# EAGLE design esp12_Epaper4.2 (EAGLE 9.6.0)
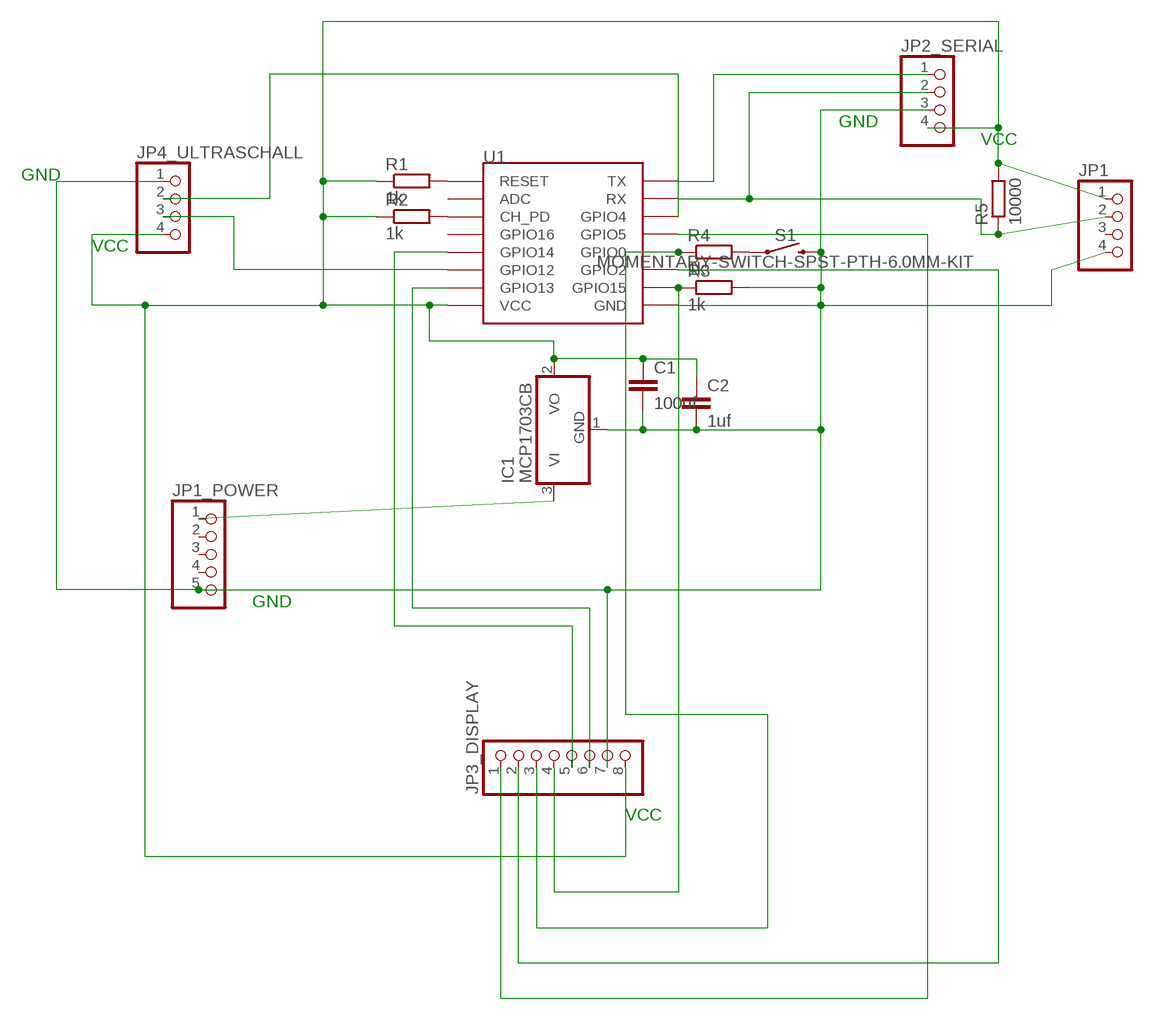
[diagram p0: schematic, sheet 1]

## Parts
C1  100uf  C-EU025-050X050  [C025-050X050]
C2  1uf  C-EU025-050X050  [C025-050X050]
IC1  MCP1703CB  [SOT23]
JP1  PINHD-1X4  [1X04]
JP1_POWER  PINHD-1X5  [1X05]
JP2_SERIAL  PINHD-1X4/90  [1X04/90]
JP3_DISPLAY  PINHD-1X8/90  [1X08/90]
JP4_ULTRASCHALL  PINHD-1X4  [1X04]
R1  1k  R-EU_R1206  [R1206]
R2  1k  R-EU_R1206  [R1206]
R3  1k  R-EU_R1206  [R1206]
R4  1k  R-EU_R1206  [R1206]
R5  10000  R-EU_M1206  [M1206]
S1  MOMENTARY-SWITCH-SPST-PTH-6.0MM-KIT  [TACTILE_SWITCH_PTH_6.0MM_KIT]
U1  ESP12  [ESP12]

## Nets
GND: C1.2 C2.2 IC1.1(GND) JP1.4 JP1_POWER.5 JP2_SERIAL.3 JP3_DISPLAY.7 JP4_ULTRASCHALL.1 R3.2 S1.3 U1.GND
N$2: R1.2 U1.RESET
N$3: R2.2 U1.CH_PD
N$4: JP3_DISPLAY.3 R4.1 U1.GPIO0
N$5: JP4_ULTRASCHALL.2 U1.GPIO4
N$6: R4.2 S1.1
N$7: JP2_SERIAL.1 U1.TX
N$8: JP1.2 JP2_SERIAL.2 R5.1 U1.RX
N$10: IC1.3(VI) JP1_POWER.1
N$11: JP3_DISPLAY.5 U1.GPIO14
N$12: JP3_DISPLAY.6 U1.GPIO13
N$14: JP3_DISPLAY.2 U1.GPIO2
N$15: JP3_DISPLAY.1 U1.GPIO5
N$16: JP4_ULTRASCHALL.3 U1.GPIO12
N$20: JP3_DISPLAY.4 R3.1 U1.GPIO15
VCC: C1.1 C2.1 IC1.2(VO) JP1.1 JP2_SERIAL.4 JP3_DISPLAY.8 JP4_ULTRASCHALL.4 R1.1 R2.1 R5.2 U1.VCC
Unconnected: JP1.3 JP1_POWER.2 JP1_POWER.3 JP1_POWER.4 U1.ADC U1.GPIO16

## Notes on the sheet
- GND
- VCC
- GND
- VCC
- GND
- VCC

## Library data of the parts
C1 C2 = rcl:C-EU: CAPACITOR, European symbol; SPICEPREFIX: C
IC1 = linear:MCP1703: 250 mA, 16V, Low Quiescent Current LDO Regulator Source: http://ww1.microchip.com/downloads/en/DeviceDoc/22049b.pdf
JP1 JP2_SERIAL JP4_ULTRASCHALL = pinhead:PINHD-1X4: PIN HEADER
JP1_POWER = pinhead:PINHD-1X5: PIN HEADER
JP3_DISPLAY = pinhead:PINHD-1X8: PIN HEADER
R1-R5 = rcl:R-EU_: RESISTOR, European symbol; SPICEPREFIX: R
S1 = SparkFun-Switches:MOMENTARY-SWITCH-SPST: Momentary Switch (Pushbutton) - SPST Normally-open (NO) SPST momentary switches (buttons, pushbuttons). Variants PTH-12MM - 12mm square, through-hole Momentary Pushbutton Switch - 12mm Square <https://www.sparkfun.com/products/9190> (COM-09190) PTH-6.0MM, PTH-6.0MM-KIT - 6.0mm square, through-hole Mini Pushbutton Switch <https://www.sparkfun.com/products/97> (COM-00097) KIT package intended for soldering kit's - only one side of pads' copper is exposed. PTH-RIGHT-ANGLE-KIT - Right-angle, through-hole Right Angle Tactile Button <https://www.sparkfun.com/products/10791> - Used on SparkFun BigTime Watch Kit <https://www.sparkfun.com/products/11734> SMD-12MM - 12mm square, surface-mount Tactile Button - SMD (12mm) <https://www.sparkfun.com/products/12993> (COM-12993) Used on SparkFun PicoBoard <https://www.sparkfun.com/products/11888> SMD-4.5MM - 4.5mm Square Trackball Switch Used on SparkFun Blackberry Trackballer Breakout <https://www.sparkfun.com/products/13169> SMD-4.6MMX2.8MM - 4.60mm x 2.80mm, surface mount Used on SparkFun SAMD21 Mini Breakout <https://www.sparkfun.com/products/13664> SMD-5.2MM, SMD-5.2-REDUNDANT - 5.2mm square, surface-mount Mini Pushbutton Switch - SMD <https://www.sparkfun.com/products/8720> (COM-08720) Used on Arduino Pro Mini <https://www.sparkfun.com/products/11114> REDUNDANT package connects both switch circuits together SMD-6.0X3.5MM - 6.0 x 3.5mm, surface mount Momentary Reset Switch SMD <https://www.sparkfun.com/products/8229> (COM-08229) SMD-6.2MM-TALL - 6.2mm square, surface mount Tactile Button - SMD (6mm) <https://www.sparkfun.com/products/12992> Used on SparkFun Digital Sandbox <https://www.sparkfun.com/products/12651> SMD-RIGHT-ANGLE - Right-angle, surface mount Used on SparkFun Block for Intel® Edison - Arduino <https://www.sparkfun.com/products/13036>; PROD_ID: SWCH-08441; SF_SKU: COM-00097
U1 = esp8266modules:ESP12: ESP8266 Wifi module 12

## Board
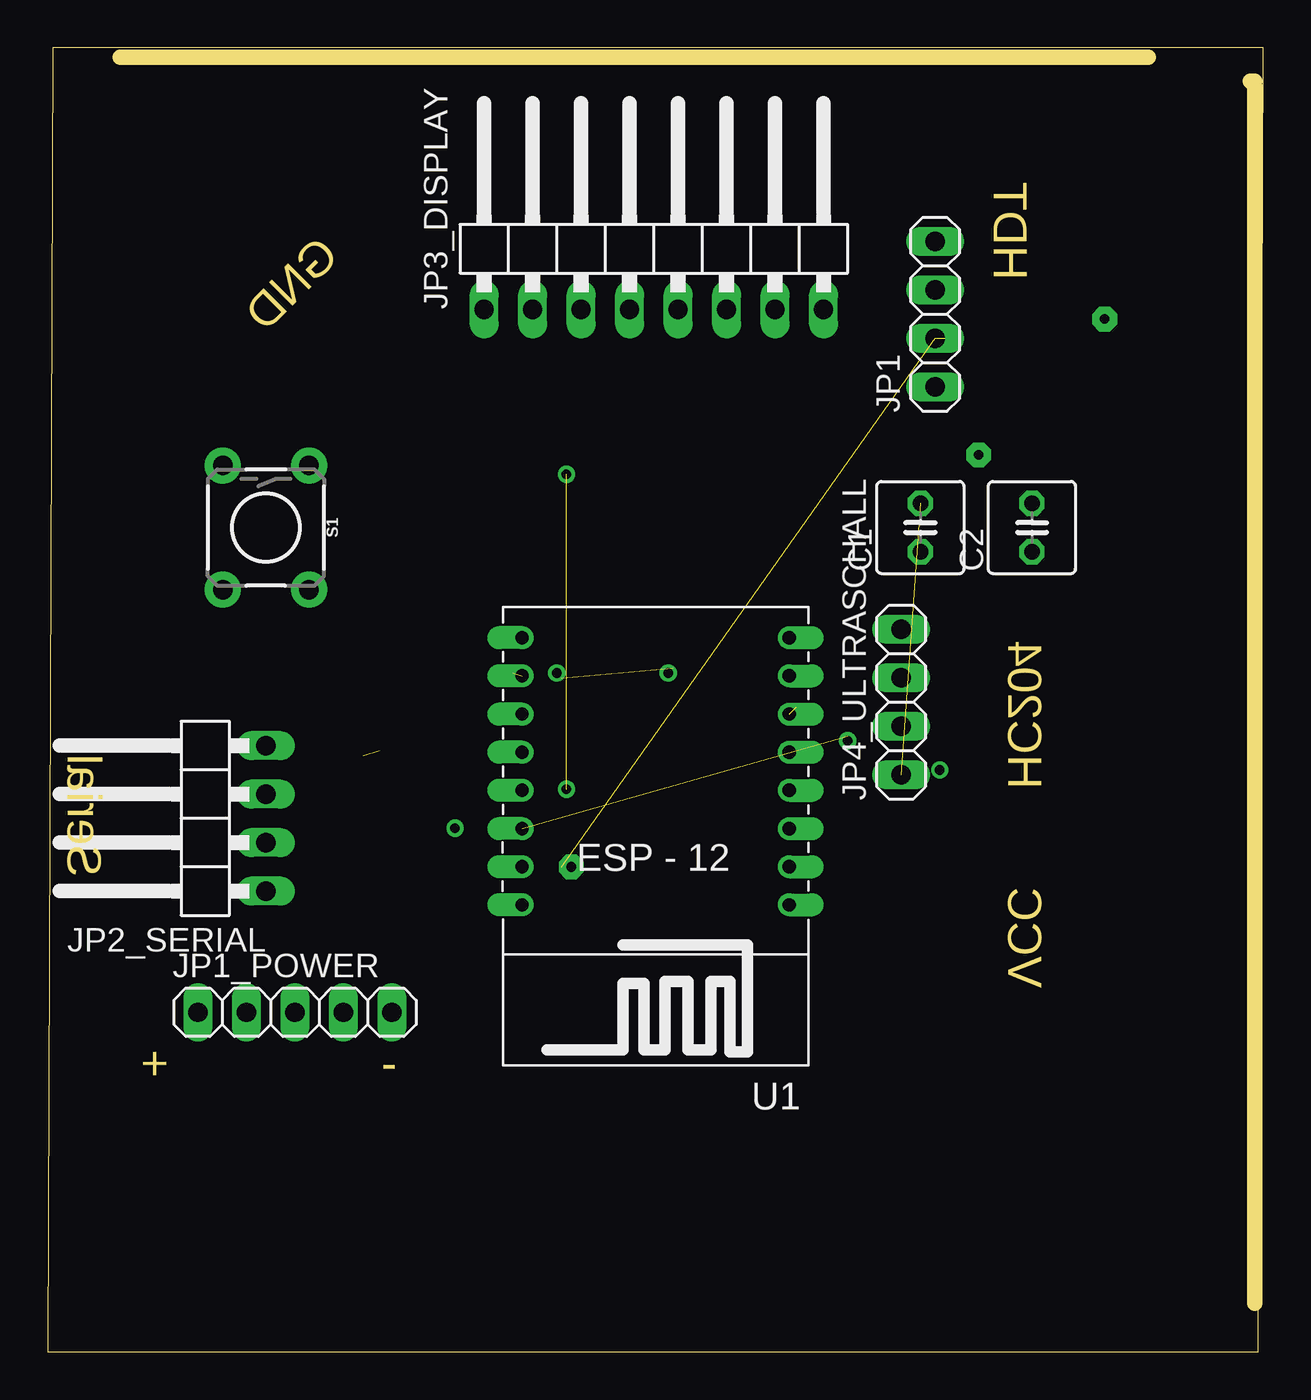
[diagram p1: board, top side]
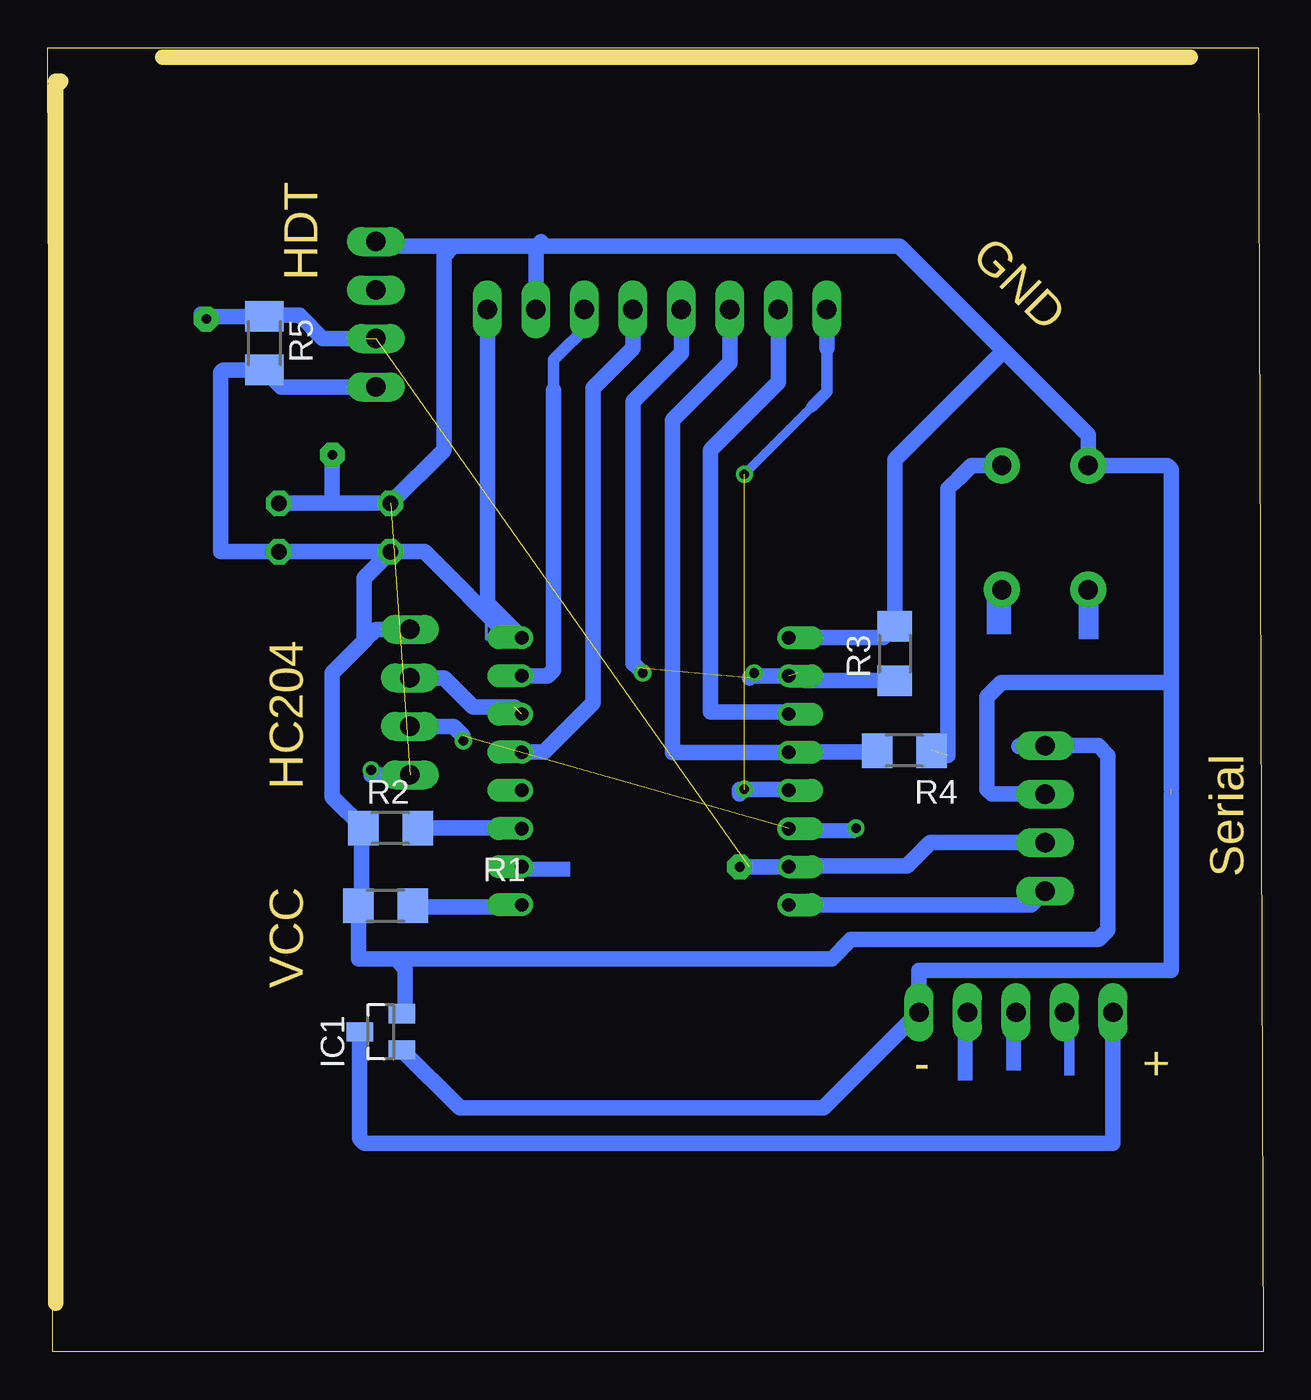
[diagram p2: board, bottom side, seen from below]

Size 63.68 x 68.32 mm. Coordinates in mm from the lower left corner, seen from the top.
Outline: 0,0 63.42,0 63.68,68.32 0.25,68.32 0,0
Copper layers (1*16): Top 0.035mm / dielectric 1.5mm / Bottom 0.035mm
Design rules "default": minimum track width 6mil, minimum drill 0.35mm, track to track 6mil, track to pad 6mil, pad to pad 6mil, via to via 6mil, smd to smd 6mil, copper to edge 40mil, drill to drill 6mil, minimum pad ring 10mil, minimum via ring 8mil, stop-mask expansion 4mil, vias tented up to drill 0mil, thermal gap 10mil
Milling: 4 lines

### Footprints (pad centres in the part's own frame; a part is rotated, then mirrored left to right if it is on the bottom)
C025-050X050 = drill 0.813 octagon: 1 -1.27,0; 2 1.27,0
SOT23 = smd 1 x 1.4: 1 -0.95,-1.1; 2 0.95,-1.1; 3 0,1.1
1X04 = drill 1.016 long: 1 -3.81,0; 2 -1.27,0; 3 1.27,0; 4 3.81,0
1X05 = drill 1.016 long: 1 -5.08,0; 2 -2.54,0; 3 0,0; 4 2.54,0; 5 5.08,0
1X04/90 = drill 1.016 long: 1 -3.81,-3.81; 2 -1.27,-3.81; 3 1.27,-3.81; 4 3.81,-3.81
1X08/90 = drill 1.016 long: 1 -8.89,-3.81; 2 -6.35,-3.81; 3 -3.81,-3.81; 4 -1.27,-3.81; 5 1.27,-3.81; 6 3.81,-3.81; 7 6.35,-3.81; 8 8.89,-3.81
R1206 = smd 1.6 x 1.803: 1 -1.422,0; 2 1.422,0
M1206 = smd 1.6 x 2: 1 -1.4,0; 2 1.4,0
TACTILE_SWITCH_PTH_6.0MM_KIT = drill 1.016 pad 1.88: 1 -3.251,2.261; 2 3.251,2.261; 3 -3.251,-2.261; 4 3.251,-2.261
ESP12 = drill 0.7 offset: ADC -7.1,3.8; CH_PD -7.1,1.8; GND 6.9,-8.2; GPIO0 6.9,-2.2; GPIO2 6.9,-4.2; GPIO4 6.9,1.8; GPIO5 6.9,-0.2; GPIO12 -7.1,-4.2; GPIO13 -7.1,-6.2; GPIO14 -7.1,-2.2; GPIO15 6.9,-6.2; GPIO16 -7.1,-0.2; RESET -7.1,5.8; RX 6.9,3.8; TX 6.9,5.8; VCC -7.1,-8.2

### Placement (x,y rotation side)
C1  45.72,43.18 90 top
C2  51.56,43.18 90 top
IC1  46.23,16.76 90 bottom
JP1  46.48,54.36 90 top
JP1_POWER  12.95,17.78 0 top
JP2_SERIAL  7.62,27.94 90 top
JP3_DISPLAY  31.75,58.42 0 top
JP4_ULTRASCHALL  44.7,34.04 90 top
R1  45.97,23.37 0 bottom
R2  45.72,27.43 0 bottom
R3  19.3,36.58 90 bottom
R4  18.8,31.5 0 bottom
R5  52.32,52.83 270 bottom
S1  11.43,43.18 270 top
U1  31.75,29.21 180 top

### Tracks (layer width: path | path; a pad name or v marks a point on that pad's centre or on a via)
GND  (via drill 0.5 pad 1.3)  (2 unrouted)
  Bottom 0.152: 24.99,37.49 U1.GND | 38.1,54.71 JP3_DISPLAY.7 | 9.3,46.33 S1.3 9.3,46.48 | 18.03,18.9 JP1_POWER.5 | 11.38,29.26 JP2_SERIAL.3
  Bottom 0.813: IC1.1 42.08,12.77 23.05,12.77 JP1_POWER.5 18.03,19.99 4.83,19.99 4.83,29.21 | 4.83,35.05 4.83,46.23 5.03,46.43 S1.3 9.17,48.03 13.59,52.45 | 4.83,35.05 4.83,29.46 | 11.18,29.46 JP2_SERIAL.3 14.22,29.21 14.48,29.46 14.48,34.29 13.72,35.05 4.83,35.05 | JP3_DISPLAY.7 38.1,57.91 | 38.1,57.91 37.85,58.17 | 38.1,57.91 42.42,57.91 | 42.42,57.91 42.93,57.4 42.93,47.24 C1.2 48.77,44.45 | 38.1,57.91 19.05,57.91 13.59,52.45 | U1.GND 23.95,37.41 | 23.95,37.41 23.88,37.34 | 13.59,52.45 19.3,46.74 R3.2 19.89,37.41 23.95,37.41 | JP4_ULTRASCHALL.1 46.74,30.23 | C2.2 48.77,44.45 | JP1.4 46.23,57.91 42.42,57.91 | 48.77,44.45 v48.77,46.99 49.02,46.99
N$1  (via drill 0.5)
  other vias: 46.74,30.48
N$2
  Bottom 0.152: 39.62,23.32 38.86,23.32 U1.RESET
  Bottom 0.813: R1.2 44.5,23.32 39.62,23.32
N$3
  Bottom 0.152: 39.62,27.43 38.86,27.43 U1.CH_PD
  Bottom 0.813: R2.2 39.62,27.43
N$4
  Bottom 0.152: 28.35,54.71 28.04,54.71 JP3_DISPLAY.3
  Bottom 0.813: JP3_DISPLAY.3 27.94,51.82 30.94,48.82 30.94,31.39 24.83,31.39 U1.GPIO0 20.3,31.41 R4.1
N$5  (1 unrouted)
  Bottom 0.813: 41.91,32.26 42.42,32.77 JP4_ULTRASCHALL.2
N$6  (1 unrouted)
  Bottom 0.813: S1.1 15.29,46.43 16,45.72 16.51,45.21 16.51,31.24
N$7
  Bottom 0.813: JP2_SERIAL.1 12.15,23.41 U1.TX
N$8  (2 unrouted)
  Bottom 0.152: 23.62,25.45 24.84,25.45 U1.RX
  Bottom 0.813: 23.62,25.45 18.66,25.45 17.44,26.67 JP2_SERIAL.2 | 46.99,53.09 49.28,53.09 50.48,54.29 52.26,54.29 R5.1 55.5,54.23 55.63,54.36 | U1.RX 26.91,25.41 26.92,25.4
N$9  (via drill 0.5)
  other vias: 21.34,27.43
N$10
  Bottom 0.813: IC1.3 47.33,11.18 47.07,10.92 7.87,10.92 JP1_POWER.1
N$11
  Bottom 0.813: U1.GPIO14 37.68,31.41 35.1,33.98 35.1,50.49 33.02,52.58 JP3_DISPLAY.5
N$12
  Bottom 0.152: 37.38,50.76 37.19,50.37
  Bottom 0.61: 37.19,50.37 37.19,51.97 35.31,53.85 35.31,54.36 JP3_DISPLAY.6
  Bottom 0.813: U1.GPIO13 37.49,35.41 37.19,35.71 37.19,50.37
N$13  (via drill 0.5)
  other vias: 26.67,35.56
N$14
  Bottom 0.813: U1.GPIO2 24.97,33.53 28.96,33.53 28.96,47.24 25.4,50.8 JP3_DISPLAY.2
N$15  (via drill 0.5)  (1 unrouted)
  Bottom 0.152: 22.71,54.41 22.86,54.56 JP3_DISPLAY.1
  Bottom 0.508: v27.18,45.97 23.64,49.51
  Bottom 0.61: 23.64,49.51 22.86,50.29 22.86,52.58
  Bottom 0.813: 22.86,52.58 JP3_DISPLAY.1 | U1.GPIO5 24.9,29.46 v27.18,29.46 27.43,29.46 27.43,29.21
N$16  (1 unrouted)
  Bottom 0.813: 39.22,33.78 41.4,33.78 42.93,35.31 JP4_ULTRASCHALL.3
N$17  (via drill 0.5)
  other vias: 41.91,32
N$18  (via drill 0.5 pad 1.3)
  other vias: 55.37,54.1
N$19  (via drill 0.5 pad 1.3)
  other vias: 27.43,25.4
N$20  (2 unrouted)
  Bottom 0.152: 30.48,54.56 JP3_DISPLAY.4
  Bottom 0.813: R3.1 23.98,35.15 24.38,35.56 | JP3_DISPLAY.4 30.48,52.32 33.02,49.78 33.02,36.07 32.77,35.81 | U1.GPIO15 26.82,35.41 26.92,35.31
N$21  (via drill 0.5)
  other vias: 32.51,35.56
VCC
  Bottom 0.152: 47.09,37.34 46.99,37.34 | U1.VCC 38.86,37.34 39.37,37.34 40.69,37.34 40.69,54.56 JP3_DISPLAY.8 | 47.4,23.11 R1.1 | 47.24,27.43 R2.1 47.09,27.43
  Bottom 0.813: C1.1 47.09,40.54 47.09,37.34 | IC1.2 44.96,17.88 44.96,20.07 45.47,20.57 | 45.47,20.57 47.4,20.57 47.4,23.11 | R1.1 47.24,23.52 47.24,27.43 | R2.1 48.77,29.06 48.77,35.56 46.99,37.34 46.48,37.85 JP4_ULTRASCHALL.4 | C1.1 43.94,41.91 39.37,37.34 | U1.VCC 40.64,39.2 JP3_DISPLAY.8 | 12.8,31.7 12.75,31.75 JP2_SERIAL.4 8.64,31.75 8.13,31.24 8.13,22.1 8.64,21.59 21.59,21.59 22.61,20.57 45.47,20.57 | C1.1 C2.1 54.61,41.91 54.61,51.31 54.49,51.43 R5.2 51.44,50.55 JP1.1
(copper drawn outside any net)
  shapes: Bottom area x7

### Text on the board
Milling: HDT | GND | HC204 | Serial | VCC | + | -